# Altium schematic sheet Rect.SchDoc
size A4
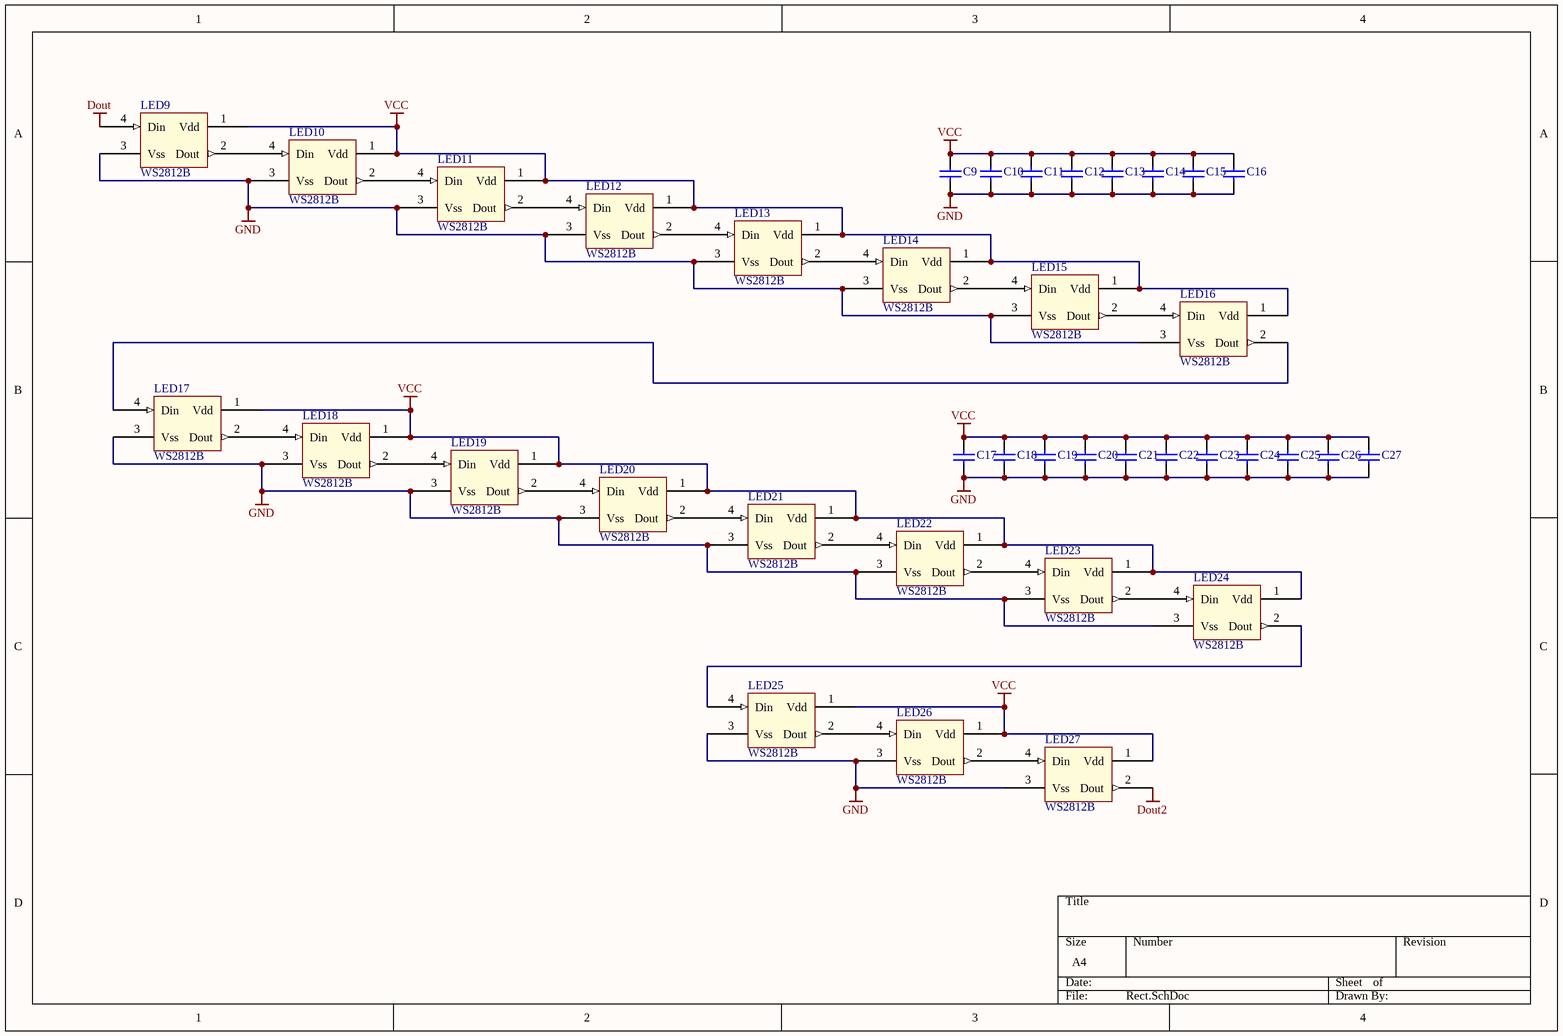
[diagram p0: Rect.SchDoc]

## Parts
C9  (no value)  [C1206]
C10  (no value)  [C1206]
C11  (no value)  [C1206]
C12  (no value)  [C1206]
C13  (no value)  [C1206]
C14  (no value)  [C1206]
C15  (no value)  [C1206]
C16  (no value)  [C1206]
C17  (no value)  [C1206]
C18  (no value)  [C1206]
C19  (no value)  [C1206]
C20  (no value)  [C1206]
C21  (no value)  [C1206]
C22  (no value)  [C1206]
C23  (no value)  [C1206]
C24  (no value)  [C1206]
C25  (no value)  [C1206]
C26  (no value)  [C1206]
C27  (no value)  [C1206]
LED9  WS2812B  [WS2812B]
LED10  WS2812B  [WS2812B]
LED11  WS2812B  [WS2812B]
LED12  WS2812B  [WS2812B]
LED13  WS2812B  [WS2812B]
LED14  WS2812B  [WS2812B]
LED15  WS2812B  [WS2812B]
LED16  WS2812B  [WS2812B]
LED17  WS2812B  [WS2812B]
LED18  WS2812B  [WS2812B]
LED19  WS2812B  [WS2812B]
LED20  WS2812B  [WS2812B]
LED21  WS2812B  [WS2812B]
LED22  WS2812B  [WS2812B]
LED23  WS2812B  [WS2812B]
LED24  WS2812B  [WS2812B]
LED25  WS2812B  [WS2812B]
LED26  WS2812B  [WS2812B]
LED27  WS2812B  [WS2812B]

## Nets
Dout: LED9.4(Din)
Dout2: LED27.2(Dout)
GND: C9.1 C10.1 C11.1 C12.1 C13.1 C14.1 C15.1 C16.1 C17.1 C18.1 C19.1 C20.1 C21.1 C22.1 C23.1 C24.1 C25.1 C26.1 C27.1 LED9.3(Vss) LED10.3(Vss) LED11.3(Vss) LED12.3(Vss) LED13.3(Vss) LED14.3(Vss) LED15.3(Vss) LED16.3(Vss) LED17.3(Vss) LED18.3(Vss) LED19.3(Vss) LED20.3(Vss) LED21.3(Vss) LED22.3(Vss) LED23.3(Vss) LED24.3(Vss) LED25.3(Vss) LED26.3(Vss) LED27.3(Vss)
VCC: C9.2 C10.2 C11.2 C12.2 C13.2 C14.2 C15.2 C16.2 C17.2 C18.2 C19.2 C20.2 C21.2 C22.2 C23.2 C24.2 C25.2 C26.2 C27.2 LED9.1(Vdd) LED10.1(Vdd) LED11.1(Vdd) LED12.1(Vdd) LED13.1(Vdd) LED14.1(Vdd) LED15.1(Vdd) LED16.1(Vdd) LED17.1(Vdd) LED18.1(Vdd) LED19.1(Vdd) LED20.1(Vdd) LED21.1(Vdd) LED22.1(Vdd) LED23.1(Vdd) LED24.1(Vdd) LED25.1(Vdd) LED26.1(Vdd) LED27.1(Vdd)
NetLED9_2: LED9.2(Dout) LED10.4(Din)
NetLED10_2: LED10.2(Dout) LED11.4(Din)
NetLED11_2: LED11.2(Dout) LED12.4(Din)
NetLED12_2: LED12.2(Dout) LED13.4(Din)
NetLED13_2: LED13.2(Dout) LED14.4(Din)
NetLED14_2: LED14.2(Dout) LED15.4(Din)
NetLED15_2: LED15.2(Dout) LED16.4(Din)
NetLED16_2: LED16.2(Dout) LED17.4(Din)
NetLED17_2: LED17.2(Dout) LED18.4(Din)
NetLED18_2: LED18.2(Dout) LED19.4(Din)
NetLED19_2: LED19.2(Dout) LED20.4(Din)
NetLED20_2: LED20.2(Dout) LED21.4(Din)
NetLED21_2: LED21.2(Dout) LED22.4(Din)
NetLED22_2: LED22.2(Dout) LED23.4(Din)
NetLED23_2: LED23.2(Dout) LED24.4(Din)
NetLED24_2: LED24.2(Dout) LED25.4(Din)
NetLED25_2: LED25.2(Dout) LED26.4(Din)
NetLED26_2: LED26.2(Dout) LED27.4(Din)

## Library data of the parts
C9-C27 = Cap: Capacitor; Value: 100nF; Published: 8-Jun-2000; LatestRevisionDate: 17-Jul-2002; LatestRevisionNote: Re-released for DXP Platform.; PackageReference: RAD-0.3; Publisher: Altium Limited; PackageDescription: Radial Cap, Thru-Hole; 2 Leads; 0.3 in Pin Spacing